# Altium schematic sheet Power_Conversion_sheet.SchDoc
size A; SheetNumber: 2; SheetTotal: 4
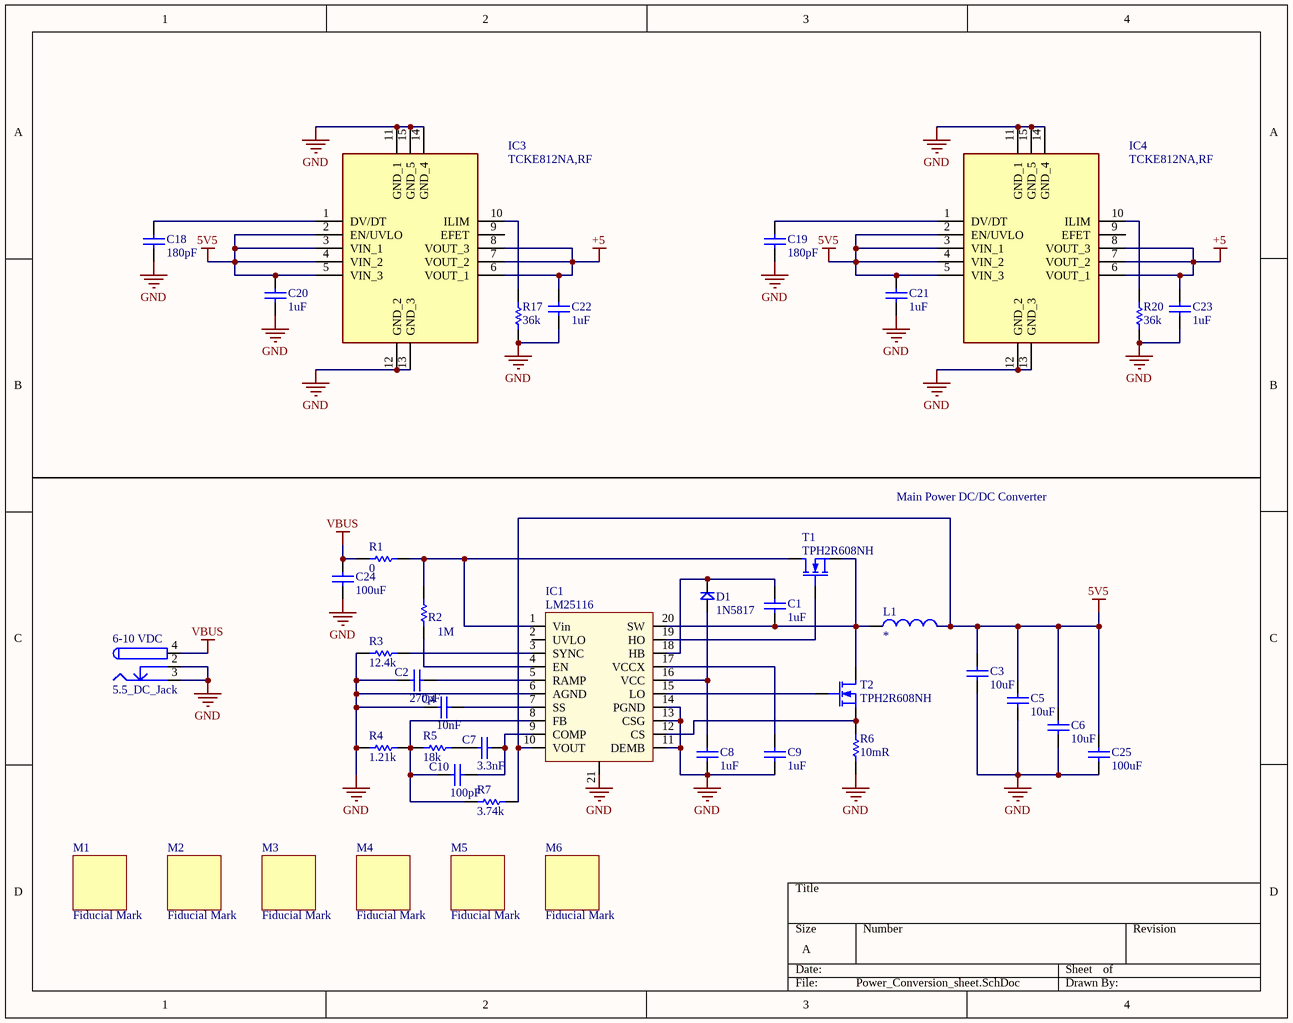
[diagram p0: Power_Conversion_sheet.SchDoc]

## Parts
6-10_VDC  5.5_DC_Jack  [5.5_DC_Jack]
C1  1uF  [C0603]
C2  270pF  [C0603]
C3  10uF  [C0603]
C4  10nF  [C0603]
C5  10uF  [C0603]
C6  10uF  [C0603]
C7  3.3nF  [C0603]
C8  1uF  [C0603]
C9  1uF  [C0603]
C10  100pF  [C0603]
C18  180pF  [C0603]
C19  180pF  [C0603]
C20  1uF  [C0603]
C21  1uF  [C0603]
C22  1uF  [C0603]
C23  1uF  [C0603]
C24  100uF  [C1206]
C25  100uF  [C1206]
D1  1N5817  [Diode-SOD-323]
IC1  LM25116  [HTSSOP-20]
IC3  TCKE812NA,RF  [TCKE812NARF]
IC4  TCKE812NA,RF  [TCKE812NARF]
L1  *  [Inductor-CDEP147]
M1  Fiducial Mark  [fiducial mark]
M2  Fiducial Mark  [fiducial mark]
M3  Fiducial Mark  [fiducial mark]
M4  Fiducial Mark  [fiducial mark]
M5  Fiducial Mark  [fiducial mark]
M6  Fiducial Mark  [fiducial mark]
R1  0  [R2010]
R2  1M  [R0603]
R3  12.4k  [R0603]
R4  1.21k  [R0603]
R5  18k  [R0603]
R6  10mR  [R2010]
R7  3.74k  [R0603]
R17  36k  [R0603]
R20  36k  [R0603]
T1  TPH2R608NH  [TPH2R608NH]
T2  TPH2R608NH  [TPH2R608NH]

## Nets
5V5: C3.2 C5.2 C6.2 C20.2 C21.2 C25.2 IC1.10(VOUT) IC3.2(EN/UVLO) IC3.3(VIN_1) IC3.4(VIN_2) IC3.5(VIN_3) IC4.2(EN/UVLO) IC4.3(VIN_1) IC4.4(VIN_2) IC4.5(VIN_3) L1.2 R7.2
+5: C22.2 C23.2 IC3.6(VOUT_1) IC3.7(VOUT_2) IC3.8(VOUT_3) IC4.6(VOUT_1) IC4.7(VOUT_2) IC4.8(VOUT_3)
GND: 6-10_VDC.2 6-10_VDC.3 C2.1 C3.1 C4.1 C5.1 C6.1 C8.1 C9.1 C18.1 C19.1 C20.1 C21.1 C22.1 C23.1 C24.1 C25.1 IC1.6(AGND) IC1.11(DEMB) IC1.13(CSG) IC1.14(PGND) IC1.21 IC3.11(GND_1) IC3.12(GND_2) IC3.13(GND_3) IC3.14(GND_4) IC3.15(GND_5) IC4.11(GND_1) IC4.12(GND_2) IC4.13(GND_3) IC4.14(GND_4) IC4.15(GND_5) R3.1 R4.1 R6.1 R17.1 R20.1
VBUS: 6-10_VDC.4 C24.2 R1.1
NetC1_1: C1.1 IC1.20(SW) L1.1 T1.3(S) T2.1(D)
NetC1_2: C1.2 D1.2(KATHODE) IC1.18(HB)
NetC2_2: C2.2 IC1.5(RAMP)
NetC4_2: C4.2 IC1.7(SS)
NetC7_1: C7.1 R5.1
NetC7_2: C7.2 C10.2 IC1.9(COMP)
NetC8_2: C8.2 D1.1(ANODE) IC1.16(VCC)
NetC9_2: C9.2 IC1.17(VCCX)
NetC10_1: C10.1 IC1.8(FB) R4.2 R5.2 R7.1
NetC18_2: C18.2 IC3.1(DV/DT)
NetC19_2: C19.2 IC4.1(DV/DT)
NetIC1_1: IC1.1(Vin) R1.2 R2.1 T1.1(D)
NetIC1_3: IC1.3(SYNC) R3.2
NetIC1_4: IC1.4(EN) R2.2
NetIC1_12: IC1.12(CS) R6.2 T2.3(S)
NetIC1_15: IC1.15(LO) T2.2(G)
NetIC1_19: IC1.19(HO) T1.2(G)
NetIC3_10: IC3.10(ILIM) R17.2
NetIC4_10: IC4.10(ILIM) R20.2

Not connected (* = marked no-connect by the designer): IC1 2(UVLO); IC3 9(EFET); IC4 9(EFET)

## Notes on the sheet
- Main Power DC/DC Converter

## Library data of the parts
C1-C10 C18-C25 = Cap
  C1 C8 C9: value: 1uF
  C2: value: 270pF
  C3 C5 C6: value: 10uF
  C4: value: 10nF
  C7: value: 3.3nF
  C10: value: 100pF
  C18-C23: value: *
  C24 C25: value: 100uF
D1 = Diode
IC1 = LM25116: Buck Controller
IC3 IC4 = TCKE812NA,RF: Integrated Circuit; Manufacturer_Name: Toshiba; Datasheet Link: https://www.arrow.com/en/products/tcke812narf/toshiba; Height: 0.75mm; Manufacturer_Part_Number: TCKE812NA,RF; Mouser Part Number: 757-TCKE812NA,RF; Mouser Price/Stock: https://www.mouser.co.uk/ProductDetail/Toshiba/TCKE812NARF?qs=7MVldsJ5UazIz%2F5VEH%2F60g%3D%3D; Arrow Part Number: TCKE812NA,RF; Arrow Price/Stock: https://www.arrow.com/en/products/tcke812narf/toshiba
L1 = Inductor: value: *
R1-R7 = Resistor
  R1: value: 0
  R2: value: 1M
  R3: value: 12.4k
  R4: value: 1.21k
  R5: value: 18k
  R6: value: 10mR
  R7: value: 3.74k
R17 R20 = Resistor: The current limit is in 3A.; value: *
T1 T2 = MOSFET-N